# EAGLE schematic Circuito eletrico (EAGLE 9.7.0)
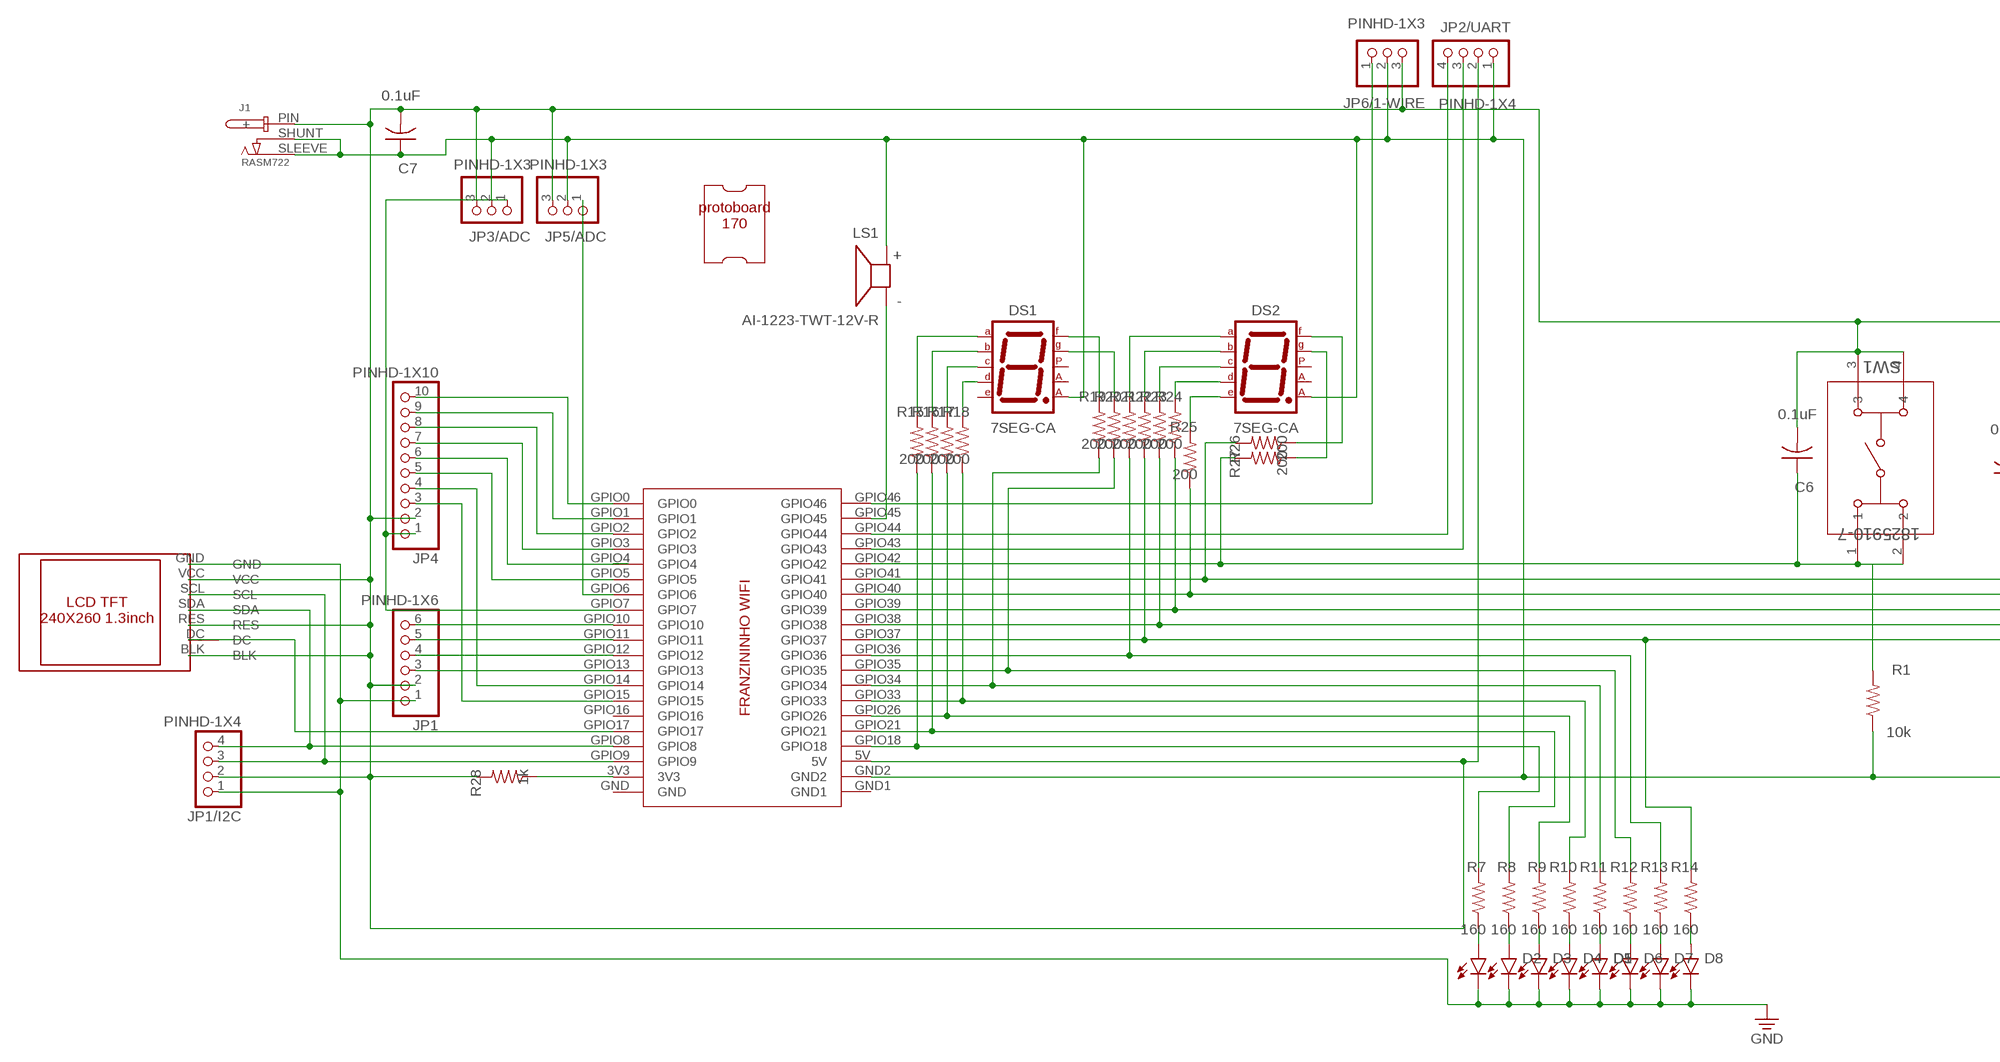
[diagram p0: schematic, sheet 1, part 1 of 2]
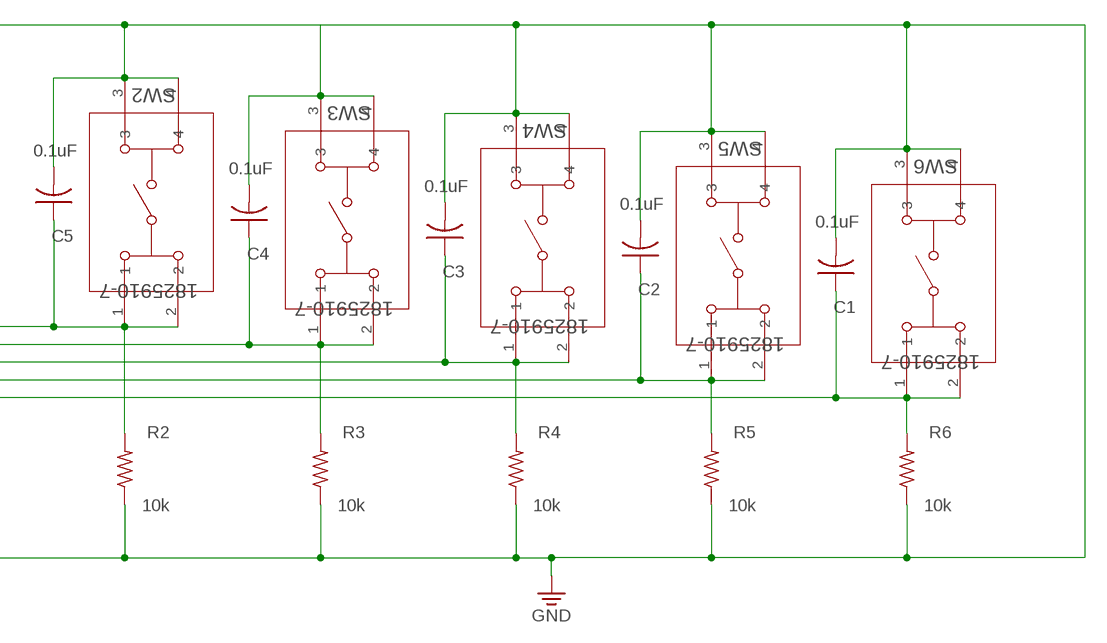
[diagram p1: schematic, sheet 1, part 2 of 2]

## Parts
C1  0.1uF  ECA-1HM2R2  [CAP_RADIAL_2MM]
C2  0.1uF  ECA-1HM2R2  [CAP_RADIAL_2MM]
C3  0.1uF  ECA-1HM2R2  [CAP_RADIAL_2MM]
C4  0.1uF  ECA-1HM2R2  [CAP_RADIAL_2MM]
C5  0.1uF  ECA-1HM2R2  [CAP_RADIAL_2MM]
C6  0.1uF  ECA-1HM2R2  [CAP_RADIAL_2MM]
C7  0.1uF  ECA-1HM2R2  [CAP_RADIAL_2MM]
D1  LED_RADIAL  [LEDRD254W60D565H860B_G]
D2  LED_RADIAL  [LEDRD254W60D565H860B_G]
D3  LED_RADIAL  [LEDRD254W60D565H860B_G]
D4  LED_RADIAL  [LEDRD254W60D565H860B_G]
D5  LED_RADIAL  [LEDRD254W60D565H860B_G]
D6  LED_RADIAL  [LEDRD254W60D565H860B_G]
D7  LED_RADIAL  [LEDRD254W60D565H860B_G]
D8  LED_RADIAL  [LEDRD254W60D565H860B_G]
DS1  7SEG-CA  [7SEG-13]
DS2  7SEG-CA  [7SEG-13]
J1  RASM722  [RASM722X]
JP1  PINHD-1X6  [1X06]
JP1/I2C  PINHD-1X4  [1X04]
JP2/UART  PINHD-1X4  [1X04]
JP3/ADC  PINHD-1X3  [1X03]
JP4  PINHD-1X10  [1X10]
JP5/ADC  PINHD-1X3  [1X03]
JP6/1-WIRE  PINHD-1X3  [1X03]
LS1  AI-1223-TWT-12V-R  [XDCR_AI-1223-TWT-12V-R]
R1  10k  R-US_AXIAL-11.7MM-PITCH  [RESAD1176W63L850D250B]
R2  10k  R-US_AXIAL-11.7MM-PITCH  [RESAD1176W63L850D250B]
R3  10k  R-US_AXIAL-11.7MM-PITCH  [RESAD1176W63L850D250B]
R4  10k  R-US_AXIAL-11.7MM-PITCH  [RESAD1176W63L850D250B]
R5  10k  R-US_AXIAL-11.7MM-PITCH  [RESAD1176W63L850D250B]
R6  10k  R-US_AXIAL-11.7MM-PITCH  [RESAD1176W63L850D250B]
R7  160  R-US_AXIAL-11.7MM-PITCH  [RESAD1176W63L850D250B]
R8  160  R-US_AXIAL-11.7MM-PITCH  [RESAD1176W63L850D250B]
R9  160  R-US_AXIAL-11.7MM-PITCH  [RESAD1176W63L850D250B]
R10  160  R-US_AXIAL-11.7MM-PITCH  [RESAD1176W63L850D250B]
R11  160  R-US_AXIAL-11.7MM-PITCH  [RESAD1176W63L850D250B]
R12  160  R-US_AXIAL-11.7MM-PITCH  [RESAD1176W63L850D250B]
R13  160  R-US_AXIAL-11.7MM-PITCH  [RESAD1176W63L850D250B]
R14  160  R-US_AXIAL-11.7MM-PITCH  [RESAD1176W63L850D250B]
R15  200  R-US_AXIAL-11.7MM-PITCH  [RESAD1176W63L850D250B]
R16  200  R-US_AXIAL-11.7MM-PITCH  [RESAD1176W63L850D250B]
R17  200  R-US_AXIAL-11.7MM-PITCH  [RESAD1176W63L850D250B]
R18  200  R-US_AXIAL-11.7MM-PITCH  [RESAD1176W63L850D250B]
R19  200  R-US_AXIAL-11.7MM-PITCH  [RESAD1176W63L850D250B]
R20  200  R-US_AXIAL-11.7MM-PITCH  [RESAD1176W63L850D250B]
R21  200  R-US_AXIAL-11.7MM-PITCH  [RESAD1176W63L850D250B]
R22  200  R-US_AXIAL-11.7MM-PITCH  [RESAD1176W63L850D250B]
R23  200  R-US_AXIAL-11.7MM-PITCH  [RESAD1176W63L850D250B]
R24  200  R-US_AXIAL-11.7MM-PITCH  [RESAD1176W63L850D250B]
R25  200  R-US_AXIAL-11.7MM-PITCH  [RESAD1176W63L850D250B]
R26  200  R-US_AXIAL-11.7MM-PITCH  [RESAD1176W63L850D250B]
R27  200  R-US_AXIAL-11.7MM-PITCH  [RESAD1176W63L850D250B]
R28  1k  R-US_AXIAL-11.7MM-PITCH  [RESAD1176W63L850D250B]
SW1  1825910-7  [SW4_1825910-B]
SW2  1825910-7  [SW4_1825910-B]
SW3  1825910-7  [SW4_1825910-B]
SW4  1825910-7  [SW4_1825910-B]
SW5  1825910-7  [SW4_1825910-B]
SW6  1825910-7  [SW4_1825910-B]
U$1  FRANZININHO  [FRANZININHO-FOOTPRINT]
U$2  LCD-TFT-1.3-240X240  [LED-TFT-FOOTPRINT]
U$3  PROTOBOARD170  [PROTOBOARD170-FOOTPRINT]

## Nets
GND: C1.2 C2.2 C3.2 C4.2 C7.1 D1.2(C) D2.2(C) D3.2(C) D4.2(C) D5.2(C) D6.2(C) D7.2(C) D8.2(C) DS1.8(CA2) DS2.8(CA2) J1.SHUNT(-) J1.SLEEVE(NEG) JP1.1 JP1/I2C.1 JP2/UART.1 JP3/ADC.2 JP5/ADC.2 JP6/1-WIRE.2 LS1.P(+) R1.1 R2.1 R3.1 R4.1 R5.1 R6.1 SW3.3 SW3.4 SW4.3 SW4.4 SW5.3 SW5.4 SW6.3 SW6.4 U$1.GND2 U$2.GND
N$1: JP2/UART.4 U$1.GPIO44
N$2: JP2/UART.3 U$1.GPIO43
N$3: D1.1(A) R7.1
N$4: JP1.6 U$1.GPIO10
N$5: D2.1(A) R8.1
N$6: JP6/1-WIRE.1 U$1.GPIO46
N$7: JP1/I2C.3 U$1.GPIO9 U$2.SCL
N$8: D3.1(A) R9.1
N$9: DS2.7(A) R21.2
N$10: JP1.5 U$1.GPIO11
N$11: JP1.4 U$1.GPIO12
N$12: JP1.3 U$1.GPIO13
N$13: JP5/ADC.1 U$1.GPIO6
N$14: JP3/ADC.1 JP4.1 U$1.GPIO7
N$15: C6.1 R1.2 R27.2 SW1.1 SW1.2 U$1.GPIO42
N$16: D4.1(A) R10.1
N$17: C4.1 R3.2 R25.1 SW3.1 SW3.2 U$1.GPIO40
N$18: R7.2 R15.1 U$1.GPIO18
N$19: C3.1 R4.2 R24.1 SW4.1 SW4.2 U$1.GPIO39
N$20: R8.2 R16.1 U$1.GPIO21
N$21: C2.1 R5.2 R23.1 SW5.1 SW5.2 U$1.GPIO38
N$22: R9.2 R17.1 U$1.GPIO26
N$23: C1.1 R6.2 R14.2 R22.1 SW6.1 SW6.2 U$1.GPIO37
N$24: R10.2 R18.1 U$1.GPIO33
N$25: R11.2 R19.1 U$1.GPIO34
N$26: R12.2 R20.1 U$1.GPIO35
N$27: R13.2 R21.1 U$1.GPIO36
N$28: C5.2 C6.2 C7.2 J1.PIN(+) JP1.2 JP1/I2C.2 JP2/UART.2 JP3/ADC.3 JP4.2 JP5/ADC.3 JP6/1-WIRE.3 R28.2 SW1.3 SW1.4 SW2.3 SW2.4 U$1.5V U$2.BLK U$2.RES U$2.VCC
N$29: D5.1(A) R11.1
N$30: D6.1(A) R12.1
N$31: D7.1(A) R13.1
N$32: D8.1(A) R14.1
N$33: C5.1 R2.2 R26.2 SW2.1 SW2.2 U$1.GPIO41
N$34: DS1.7(A) R15.2
N$35: DS1.6(B) R16.2
N$36: DS1.4(C) R17.2
N$37: DS1.2(D) R18.2
N$38: U$1.GPIO17 U$2.DC
N$39: JP1/I2C.4 U$1.GPIO8 U$2.SDA
N$40: DS1.9(F) R19.2
N$41: JP4.6 U$1.GPIO4
N$42: DS1.10(G) R20.2
N$43: DS2.6(B) R22.2
N$44: DS2.4(C) R23.2
N$45: DS2.2(D) R24.2
N$46: DS2.1(E) R25.2
N$47: DS2.9(F) R26.1
N$48: DS2.10(G) R27.1
N$49: LS1.N(-) U$1.GPIO45
N$50: JP4.10 U$1.GPIO0
N$51: JP4.9 U$1.GPIO1
N$52: JP4.8 U$1.GPIO2
N$53: JP4.7 U$1.GPIO3
N$54: JP4.5 U$1.GPIO5
N$55: JP4.4 U$1.GPIO14
N$56: JP4.3 U$1.GPIO15
N$57: R28.1 U$1.3V3
Unconnected: DS1.1(E) DS1.3(CA1) DS1.5(DP) DS2.3(CA1) DS2.5(DP) U$1.GND U$1.GND1 U$1.GPIO16

## Library data of the parts
C1-C7 = Resistor_Capacitor:ECA-1HM2R2: CAP ALUM 2.2UF 20% 50V RADIAL Manufacturer's datasheet <https://media.digikey.com/pdf/Data%20Sheets/Panasonic%20Electronic%20Components/ECA-xxM%20Series,TypeA.pdf>; CREATED_BY: PCBLayout.com; DIGIKEY_PART_NUMBER: P5175-ND; MANUFACTURER: Panasonic Electronic Components; MPN: ECA-1HM2R2; PACKAGE: CAP RADIAL 2MM LS
D1-D8 = Library:LED_RADIAL: LED - Generic
DS1 DS2 = Opto-Electronic:7SEG-CA: 7-segment DISPLAY single anode, 13 mm; CATEGORY: Opto-Electronic; SUB-CATEGORY: Display; TYPE: 7-Segment
J1 = Connector:RASM722: CONN PWR JACK 2.1X5.5MM SOLDER Manufacturer's datasheet <http://www.switchcraft.com/Documents/EDG4.pdf#page=135>; CREATED_BY: PCBLayout.com; DIGI-KEY_PART_NO: RASM722X-ND; MANUFACTURER: Switchcraft Inc.; MPN: RASM722X
JP1 = Connector:PINHD-1X6: PIN HEADER; CATEGORY: CONNECTOR; SUB-CATEGORY: PIN-HEADER
JP1/I2C JP2/UART = Connector:PINHD-1X4: PIN HEADER; CATEGORY: CONNECTOR; SUB-CATEGORY: PIN-HEADER
JP3/ADC JP5/ADC JP6/1-WIRE = Connector:PINHD-1X3: PIN HEADER; CATEGORY: CONNECTOR; SUB-CATEGORY: PIN-HEADER
JP4 = Connector:PINHD-1X10: PIN HEADER; CATEGORY: CONNECTOR; SUB-CATEGORY: PIN-HEADER
LS1 = AI-1223-TWT-12V-R:AI-1223-TWT-12V-R; MANUFACTURER: PUI Audio; MAXIMUM_PACKAGE_HEIGHT: 9.7 mm; PARTREV: F; STANDARD: IPC 7351B
R1-R28 = Tutorial - Fusion 360:R-US: Resistor Fixed - ANSI; CATEGORY: Resistor; SUB-CATEGORY: Fixed
SW1-SW6 = Switches:1825910-7; BUILT_BY: EMA_UL_Team; CATEGORY: Tactile Switches; CONFIGURATION__POLE-THROW_: Single Pole - Single Throw; COPYRIGHT: Copyright (C) 2016 Accelerated Designs. All rights reserved; DESCRIPTION: FSM4JAH=6MM TACT SWITCH, HIGH TEMP; MANUFACTURER_PART_NUMBER: 1825910-7; MAX_SWITCHING_CURRENT: -; MAX_SWITCHING_VOLTAGE_AC_: -; PART_STATUS: active; PRODUCT_TYPE: Switch; SERIES: Unknown; SWITCH_TYPE: Tactile Switches; TE_PART_NUMBER: 1825910-7; VENDOR: TE Connectivity
U$1 = Franzininho Library:FRANZININHO
U$2 = LCD Library:LCD-TFT-1.3-240X240
U$3 = Protoboard Library:PROTOBOARD170